# Altium schematic sheet ESP32.SchDoc
size A
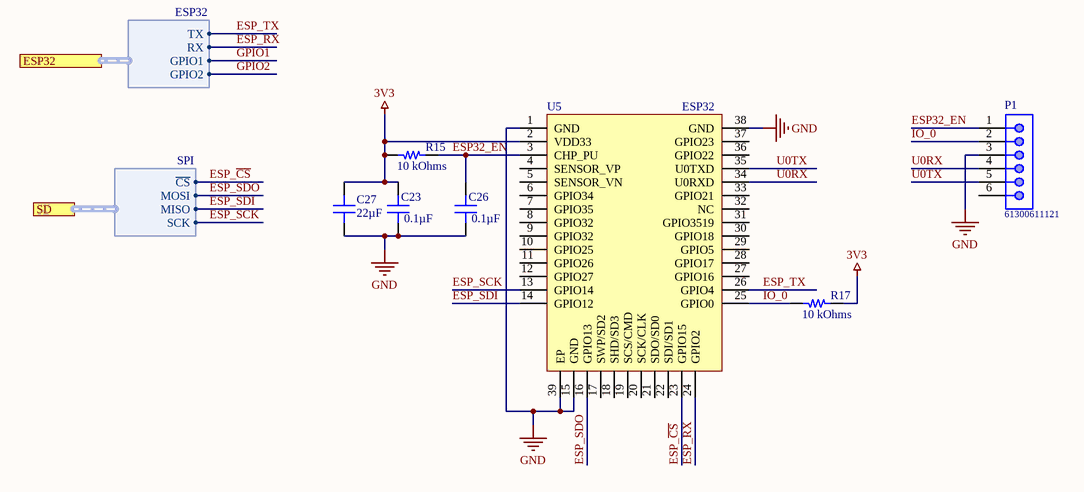
[diagram p0: ESP32.SchDoc]

## Parts
C23  0.1µF  [CAP 0603_1608]
C26  0.1µF  [CAP 0603_1608]
C27  22µF  [CAP 0805_2012]
P1  61300611121  [61300611121]
R15  10 kOhms  [RES 0603_1608]
R17  10 kOhms  [RES 0603_1608]
U5  ESP32  [Espressif ESP32-WROOM-32]

## Ports
ESP32 (harness ESP32), SD (harness SPI)

## Harnesses
SPI: ~{CS}, MOSI, MISO, SCK
ESP32: TX, RX, GPIO1, GPIO2

## Nets
3V3: C23.1 C27.2 R15.2 R17.1 U5.2(VDD33)
GND: C23.2 C26.2 C27.1 P1.3 U5.1(GND) U5.15(GND) U5.38(GND) U5.39(EP)
ESP32_EN: C26.1 P1.1 R15.1 U5.3(CHP_PU)
ESP_~{CS}: U5.23(GPIO15) ; port SD.~{CS}
ESP_RX: U5.24(GPIO2) ; port ESP32.RX
ESP_SCK: U5.13(GPIO14) ; port SD.SCK
ESP_SDI: U5.14(GPIO12) ; port SD.MISO
ESP_SDO: U5.16(GPIO13) ; port SD.MOSI
ESP_TX: U5.26(GPIO4) ; port ESP32.TX
GPIO1: port ESP32.GPIO1
GPIO2: port ESP32.GPIO2
IO_0: P1.2 R17.2 U5.25(GPIO0)
U0RX: P1.4 U5.34(U0RXD)
U0TX: P1.5 U5.35(U0TXD)

Not connected (* = marked no-connect by the designer): P1 6; U5 4(SENSOR_VP) 5(SENSOR_VN) 6(GPIO34) 7(GPIO35) 8(GPIO32) 9(GPIO32) 10(GPIO25) 11(GPIO26) 12(GPIO27) 17(SWP/SD2) 18(SHD/SD3) 19(SCS/CMD) 20(SCK/CLK) 21(SDO/SD0) 22(SDI/SD1) 27(GPIO16) 28(GPIO17) 29(GPIO5) 30(GPIO18) 31(GPIO3519) 32(NC) 33(GPIO21) 36(GPIO22) 37(GPIO23)

## Library data of the parts
C23 C26 = GCG188R92A104KA03D: CAP CER 0.1UF 100V 0603 EPOXY; Manufacturer: Murata Electronics; Temperature Coefficient: X8R; Tolerance: ±10%; Part Number: GCG188R92A104KA03D; Value: 0.1µF; Applications: Automotive; Capacitance: 0.1µF; ComponentLink1Description: Datasheet; ComponentLink1URL: https://search.murata.co.jp/Ceramy/image/img/A01X/G101/ENG/GCG188R92A104KA03-01.pdf; ComponentLink2Description: DigiKey Link; ComponentLink2URL: http://digikey.com/product-detail/en/murata-electronics/GCG188R92A104KA03D/490-18197-1-ND/9867926; Device Package: 0603 (1608 Metric); Features: Epoxy Mountable; LastUpdated: 21-Jan-20 12:01:59 AM; Lifecycle Status: Active; Minimum Order: 1; Mounting Type: Surface Mount, MLCC, Epoxy; Operating Temperature: -55°C ~ 150°C; Package / Case: 0603 (1608 Metric); Packaging: TapeAndReel; PartId: 9025; Part Status: Active; Price: 0.07; Ratings: AEC-Q200; Series: GCG; Size / Dimension: 0.063" L x 0.031" W (1.60mm x 0.80mm); Supplier 1: DigiKey; Supplier Part Number 1: 490-18197-1-ND; Thickness (Max): 0.035" (0.90mm); Voltage - Rated: 100V
C27 = CL21A226MOQNNNE: CAP CER 22UF 16V X5R 0805; Manufacturer: Samsung Electro-Mechanics; Tolerance: ±20%; Part Number: CL21A226MOQNNNE; Value: 22µF; Applications: General Purpose; Capacitance: 22µF; ComponentLink1Description: Datasheet; ComponentLink1URL: http://www.samsungsem.com/kr/support/product-search/mlcc/CL21A226MOQNNNE.jsp; ComponentLink2Description: DigiKey Link; ComponentLink2URL: http://digikey.com/product-detail/en/samsung-electro-mechanics/CL21A226MOQNNNE/1276-2909-1-ND/3890995; Device Package: 0805 (2012 Metric); LastUpdated: 21-Jan-20 12:03:05 AM; Lifecycle Status: Active; Minimum Order: 1; Mounting Type: Surface Mount, MLCC; Operating Temperature: -55°C ~ 85°C; Package / Case: 0805 (2012 Metric); Packaging: TapeAndReel; PartId: 3052; Part Status: Active; Price: 0.11; Series: CL; Size / Dimension: 0.079" L x 0.049" W (2.00mm x 1.25mm); Supplier 1: DigiKey; Supplier Part Number 1: 1276-2909-1-ND; Temperature Coefficient: X5R; Thickness (Max): 0.055" (1.40mm); Voltage - Rated: 16V
P1 = 61300611121: WR-PHD Pin Header, THT, pitch 2.54mm, Single Row, Vertical, 6p; Manufacturer: Wurth Elektronik; Pin Number: 6; Rated Current: 3A; Working Voltage: 250VAC; Withstanding Voltage: 500VAC; Contact Resistance: 20mOhm; ComponentLink1Description: Manufacturer; ComponentLink1URL: http://www.we-online.de; ComponentLink2Description: Datasheet; ComponentLink2URL: https://www.we-online.com/catalog/datasheet/61300611121.pdf; Manufacturer Part Number: 61300611121; Published Date: May 2020; Pitch: 2.54mm; Operating Temperature: -40 to +105degC; Mounting Technology: THT; Packaging: Bag; Gender: Pin Header; Row Number: Single; Orientation: Vertical
R15 R17 = RNCS0603BKE10K0: RES 10K OHM 0.1% 1/16W 0603; Manufacturer: Stackpole Electronics Inc; Power (Watts): 0.063W, 1/16W; Temperature Coefficient: ±25ppm/°C; Part Number: RNCS0603BKE10K0; Value: 10 kOhms; ComponentLink1Description: Datasheet; ComponentLink1URL: https://www.seielect.com/catalog/sei-rncs_rnch.pdf; ComponentLink2Description: DigiKey Link; ComponentLink2URL: http://digikey.com/product-detail/en/stackpole-electronics-inc/RNCS0603BKE10K0/RNCS0603BKE10K0CT-ND/1800113; Composition: Thin Film; Device Package: 0603 (1608 Metric); Features: Anti-Corrosive, Automotive AEC-Q200, Moisture Resistant; Height - Seated (Max): 0.022" (0.55mm); LastUpdated: 21-Jan-20 12:25:01 AM; Lifecycle Status: Active; Minimum Order: 1; Number of Terminations: 2; Operating Temperature: -55°C ~ 155°C; Package / Case: 0603 (1608 Metric); Packaging: TapeAndReel; PartId: 4838; Part Status: Active; Price: 0.08; Ratings: AEC-Q200; Resistance: 10 kOhms; Series: RNCS; Size / Dimension: 0.061" L x 0.031" W (1.55mm x 0.80mm); Supplier 1: DigiKey; Supplier Part Number 1: RNCS0603BKE10K0CT-ND; Supplier Device Package: 0603; Tolerance: ±0.1%